# EAGLE design DRV595 (EAGLE 8.0.0)
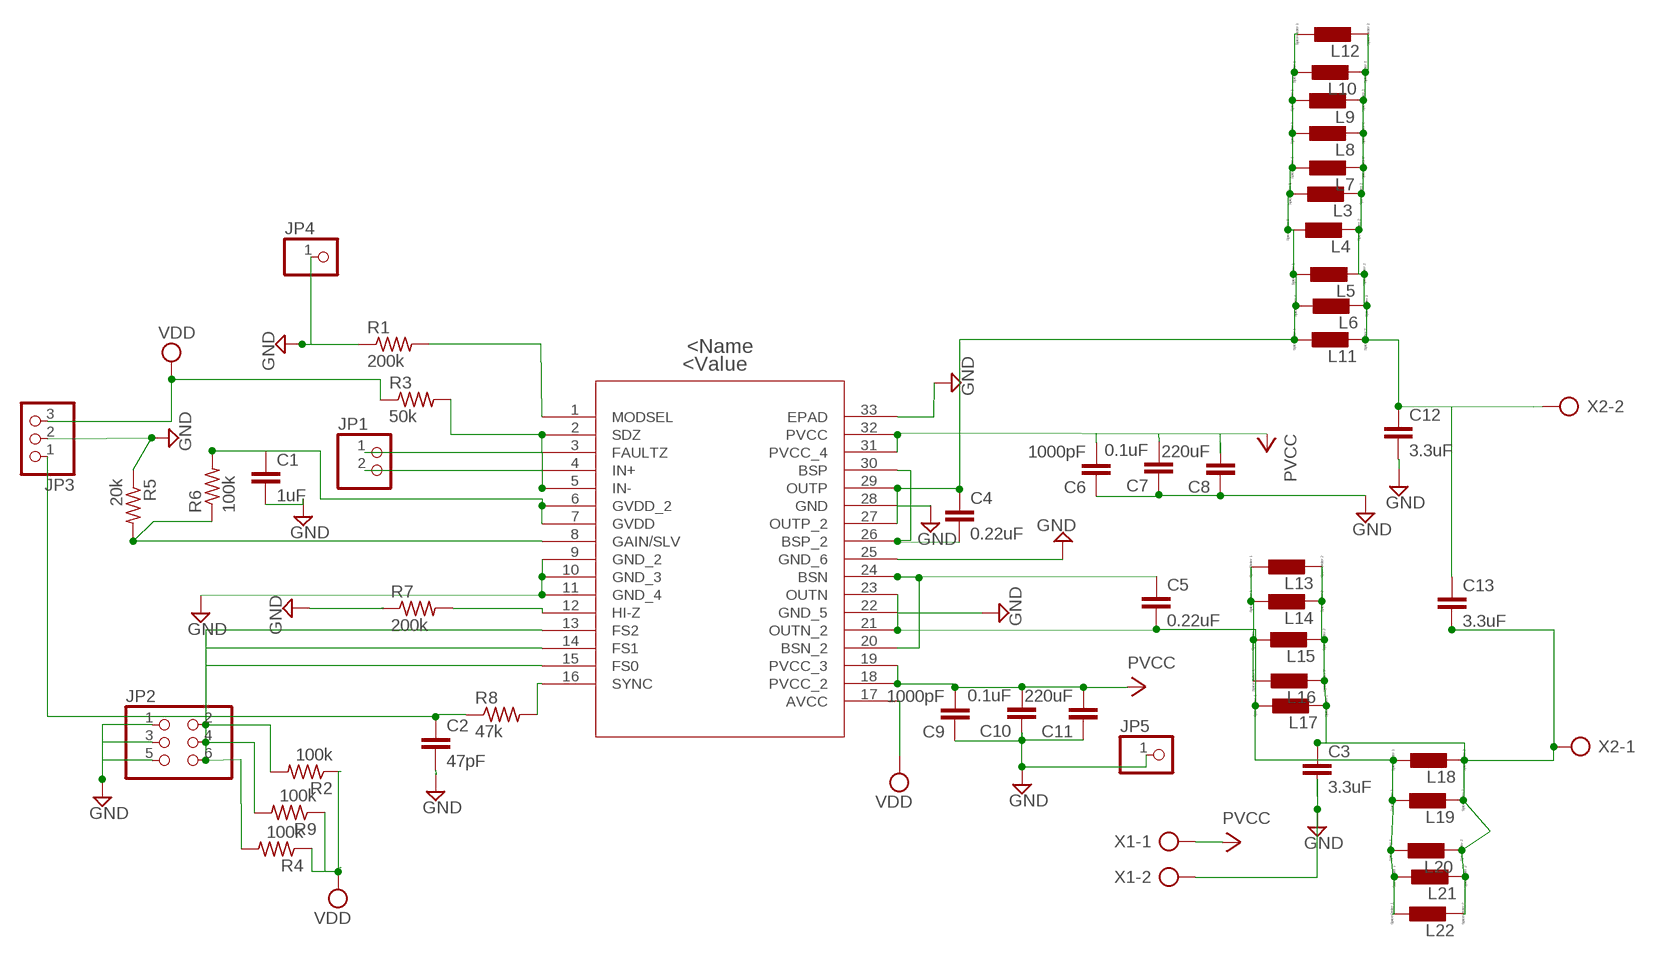
[diagram p0: schematic, sheet 1]

## Parts
C1  1uF  C2,5-3  [C2.5-3]
C2  47pF  C2,5-3  [C2.5-3]
C3  3.3uF  C2,5-3  [C2.5-3]
C4  0.22uF  C2,5-3  [C2.5-3]
C5  0.22uF  C2,5-3  [C2.5-3]
C6  1000pF  C2,5-3  [C2.5-3]
C7  0.1uF  C2,5-3  [C2.5-3]
C8  220uF  C2,5-3  [C2.5-3]
C9  1000pF  C2,5-3  [C2.5-3]
C10  0.1uF  C2,5-3  [C2.5-3]
C11  220uF  C2,5-3  [C2.5-3]
C12  3.3uF  C2,5-3  [C2.5-3]
C13  3.3uF  C2,5-3  [C2.5-3]
JP1  PINHD-1X2  [1X02]
JP2  PINHD-2X3  [2X03]
JP3  PINHD-1X3  [1X03]
JP4  PINHD-1X1  [1X01]
JP5  PINHD-1X1  [1X01]
L3  L0207/10  [0207/10]
L4  L0207/10  [0207/10]
L5  L0207/10  [0207/10]
L6  L0207/10  [0207/10]
L7  L0207/10  [0207/10]
L8  L0207/10  [0207/10]
L9  L0207/10  [0207/10]
L10  L0207/10  [0207/10]
L11  L0207/10  [0207/10]
L12  L0207/10  [0207/10]
L13  L0207/10  [0207/10]
L14  L0207/10  [0207/10]
L15  L0207/10  [0207/10]
L16  L0207/10  [0207/10]
L17  L0207/10  [0207/10]
L18  L0207/10  [0207/10]
L19  L0207/10  [0207/10]
L20  L0207/10  [0207/10]
L21  L0207/10  [0207/10]
L22  L0207/10  [0207/10]
R1  200k  R-US_0207/10  [0207/10]
R2  100k  R-US_0207/10  [0207/10]
R3  50k  R-US_0207/10  [0207/10]
R4  100k  R-US_0207/10  [0207/10]
R5  20k  R-US_0207/10  [0207/10]
R6  100k  R-US_0207/10  [0207/10]
R7  200k  R-US_0207/10  [0207/10]
R8  47k  R-US_0207/10  [0207/10]
R9  100k  R-US_0207/10  [0207/10]
U1  DRV595DAPRDAP32_4P11X4P36-L  [DAP32_4P11X4P36-L]
X1  AK300/2  [AK300/2]
X2  AK500/2-H  [AK500/2-H]

## Nets
GND: C1.2 C2.2 C3.2 C6.1 C7.1 C8.1 C9.1 C10.1 C11.1 C12.2 JP2.1 JP2.3 JP2.5 JP3.2 JP4.1 JP5.1 R1.1 R5.1 R7.1 U1.9(GND_2) U1.10(GND_3) U1.11(GND_4) U1.22(GND_5) U1.25(GND_6) U1.28(GND) U1.33(EPAD) X1.2
N$1: R1.2 U1.1(MODSEL)
N$2: JP1.1 U1.4(IN+)
N$3: R3.2 U1.2(SDZ) U1.3(FAULTZ)
N$4: R5.2 R6.1 U1.8(GAIN/SLV)
N$5: C1.1 R6.2 U1.6(GVDD_2) U1.7(GVDD)
N$6: R7.2 U1.12(HI-Z)
N$7: R8.2 U1.16(SYNC)
N$8: C2.1 JP3.1 R8.1
N$9: JP2.2 R2.2 U1.13(FS2)
N$11: C5.1 U1.20(BSN_2) U1.24(BSN)
N$12: C4.2 U1.26(BSP_2) U1.30(BSP)
N$13: JP2.4 R9.2 U1.14(FS1)
N$14: JP1.2 U1.5(IN-)
N$15: JP2.6 R4.2 U1.15(FS0)
N$16: C3.1 C13.2 L13.2 L14.2 L15.2 L16.2 L17.2 L18.2 L19.2 L20.2 L21.2 L22.2 X2.1
N$17: C12.1 C13.1 L3.2 L4.2 L5.2 L6.2 L7.2 L8.2 L9.2 L10.2 L11.2 L12.2 X2.2
N$19: C5.2 L13.1 L14.1 L15.1 L16.1 L17.1 L18.1 L19.1 L20.1 L21.1 L22.1 U1.21(OUTN_2) U1.23(OUTN)
N$21: C4.1 L3.1 L4.1 L5.1 L6.1 L7.1 L8.1 L9.1 L10.1 L11.1 L12.1 U1.27(OUTP_2) U1.29(OUTP)
VCC: C6.2 C7.2 C8.2 C9.2 C10.2 C11.2 U1.18(PVCC_2) U1.19(PVCC_3) U1.31(PVCC_4) U1.32(PVCC) X1.1 ; supply symbol labelled PVCC
VDD: JP3.3 R2.1 R3.1 R4.1 R9.1 U1.17(AVCC)

## Library data of the parts
C1-C13 = capacitor-wima:C: CAPACITOR naming: grid - package width
JP1 = pinhead:PINHD-1X2: PIN HEADER
JP2 = pinhead:PINHD-2X3: PIN HEADER
JP3 = pinhead:PINHD-1X3: PIN HEADER
JP4 JP5 = pinhead:PINHD-1X1: PIN HEADER
L3-L22 = eagle-ltspice:L: INDUCTOR, European symbol; SPICEMODEL: NONE; SPICEPREFIX: L
R1-R9 = rcl:R-US_: RESISTOR, American symbol
U1 = DRV595:DRV595DAPR; COPYRIGHT: Copyright C 2016 Accelerated Designs. All rights reserved; MANUFACTURER_PART_NUMBER: drv595dapr; VENDOR: Texas Instruments
X1 = con-ptr500:AK300/2: CONNECTOR; OC_FARNELL: unknown; OC_NEWARK: unknown
X2 = con-ptr500:AK500/2-H: CONNECTOR Aug. 2004 / PTR Meßtechnik: Die Bezeichnung der Serie AK505 wurde geändert. Es handelt sich hierbei um AK500 in horizontaler Ausführung.; OC_FARNELL: unknown; OC_NEWARK: unknown

## Net classes
0 default: width 0.254 mm, drill 1.27 mm, clearance 0.762 mm

## Board
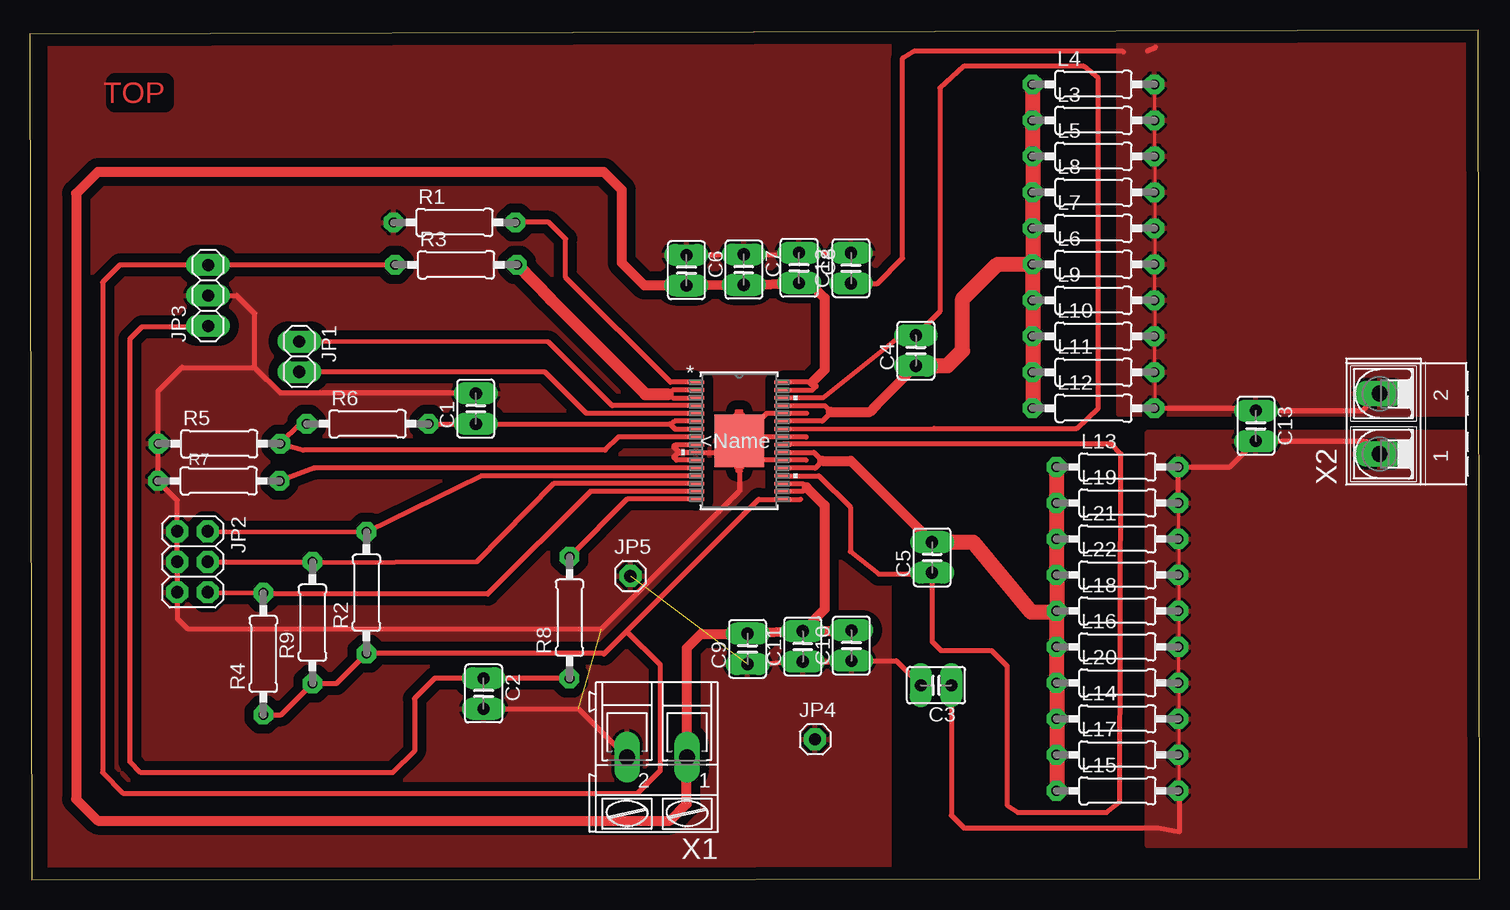
[diagram p1: board, top side]

Size 120.87 x 70.84 mm. Coordinates in mm from the lower left corner, seen from the top.
Outline: 0.15,0 120.87,0.05 120.72,70.84 0,70.49 0.15,0
Copper layers (1*16): Top 0.035mm / dielectric 1.5mm / Bottom 0.035mm
Design rules "default *": minimum track width 10mil, minimum drill 24mil, track to track 16mil, track to pad 16mil, pad to pad 16mil, via to via 16mil, smd to smd 8mil, copper to edge 40mil, drill to drill 8mil, minimum pad ring 16mil, minimum via ring 8mil, stop-mask expansion 4mil, vias tented up to drill 0mil, thermal gap 10mil

### Footprints (pad centres in the part's own frame; a part is rotated, then mirrored left to right if it is on the bottom)
C2.5-3 = drill 1.016 pad 1.6 long: 1 -1.27,0; 2 1.27,0
1X02 = drill 1.016 long: 1 -1.27,0; 2 1.27,0
2X03 = drill 1.016 octagon: 1 -2.54,-1.27; 2 -2.54,1.27; 3 0,-1.27; 4 0,1.27; 5 2.54,-1.27; 6 2.54,1.27
1X03 = drill 1.016 long: 1 -2.54,0; 2 0,0; 3 2.54,0
1X01 = drill 1.016 octagon: 1 0,0
0207/10 = drill 0.813 octagon: 1 -5.08,0; 2 5.08,0
DAP32_4P11X4P36-L = smd 1.372 x 0.305: 1 -3.619,4.875; 2 -3.619,4.225; 3 -3.619,3.575; 4 -3.619,2.925; 5 -3.619,2.275; 6 -3.619,1.625; 7 -3.619,0.975; 8 -3.619,0.325; 9 -3.619,-0.325; 10 -3.619,-0.975; 11 -3.619,-1.625; 12 -3.619,-2.275; 13 -3.619,-2.925; 14 -3.619,-3.575; 15 -3.619,-4.225; 16 -3.619,-4.875; 17 3.619,-4.875; 18 3.619,-4.225; 19 3.619,-3.575; 20 3.619,-2.925; 21 3.619,-2.275; 22 3.619,-1.625; 23 3.619,-0.975; 24 3.619,-0.325; 25 3.619,0.325; 26 3.619,0.975; 27 3.619,1.625; 28 3.619,2.275; 29 3.619,2.925; 30 3.619,3.575; 31 3.619,4.225; 32 3.619,4.875 | smd 4.11 x 4.36: 33 0,0
AK300/2 = drill 1.321 long: 1 -2.515,0; 2 2.489,0
AK500/2-H = drill 1.321 long: 1 -2.515,0; 2 2.515,0

### Placement (x,y rotation side)
C1  37.16,39.26 90 top
C2  37.81,15.51 270 top
C3  75.54,16.2 180 top
C4  73.85,44.11 90 top
C5  75.2,26.86 90 top
C6  54.72,50.8 270 top
C7  59.5,50.85 270 top
C8  64.11,51 270 top
C9  59.82,19.24 90 top
C10  68.47,19.51 90 top
C11  64.42,19.44 90 top
C12  68.44,50.98 90 top
C13  102.19,37.83 270 top
JP1  22.45,43.6 270 top
JP2  13.55,26.5 270 top
JP3  14.85,48.7 90 top
JP4  65.45,11.7 0 top
JP5  50.05,25.3 0 top
L3  88.65,63.3 0 top
L4  88.65,66.3 0 top
L5  88.65,60.3 0 top
L6  88.65,51.3 0 top
L7  88.65,54.3 0 top
L8  88.65,57.3 0 top
L9  88.65,48.3 0 top
L10  88.65,45.3 0 top
L11  88.65,42.3 0 top
L12  88.65,39.3 0 top
L13  90.65,34.4 0 top
L14  90.65,13.4 0 top
L15  90.65,7.4 0 top
L16  90.65,19.4 0 top
L17  90.65,10.4 0 top
L18  90.65,22.4 0 top
L19  90.65,31.4 0 top
L20  90.65,16.4 0 top
L21  90.65,28.4 0 top
L22  90.65,25.4 0 top
R1  35.39,54.79 0 top
R2  28.05,23.92 90 top
R3  35.51,51.26 0 top
R4  19.45,18.82 90 top
R5  15.78,36.34 0 top
R6  28.14,37.99 0 top
R7  15.73,33.24 0 top
R8  44.98,21.84 90 top
R9  23.55,21.42 90 top
U1  59.12,36.59 0 top
X1  52.25,10.2 180 top
X2  112.5,38 90 top

### Tracks (layer width: path | path; a pad name or v marks a point on that pad's centre or on a via)
GND  (2 unrouted)
  Top 0.254: 55.24,35.75 U1.10
  Top 0.406: 64.71,34.96 U1.22 59.99,34.96 59.15,35.8 | 64.71,34.96 | 64.71,36.89 64.71,36.91 U1.25 59.45,36.91 U1.33 | 64.74,38.86 U1.28 61.4,38.86 U1.33 | U1.11 53.89,34.96 53.65,35.2 54.06,35.61 U1.10 | U1.10 54.14,35.61 53.65,36.1 53.81,36.26 U1.9 | JP3.2 17.25,48.7 18.75,47.2 18.75,42.7 | 18.75,42.7 20.85,40.6 37.1,40.6 C1.2 | 18.75,42.7 12.65,42.7 10.7,40.75 R5.1 10.7,33.29 R7.1 12.28,31.61 JP2.1 JP2.3 JP2.5 12.28,21.77 13.15,20.9 47.65,20.9 59.15,32.4 59.15,35.8 | U1.10 58.15,35.61 58.74,36.21 | U1.33 58.74,36.21 | 59.15,35.8 58.74,36.21 | C6.1 59.46,52.08 C7.1 63.96,52.12 C8.1 68.41,52.28 C12.2 | C9.1 C11.1 68.97,18.16 69.05,18.24 | C2.2 45.72,14.24 X1.2 | 69.05,18.24 C10.1 | 69.05,18.24 72.22,18.24 C3.2
  pour Top: 1.65,0.8 71.65,0.8 71.65,70.9 1.65,70.9
N$1
  Top 0.406: U1.1 53.39,41.46 44.65,50.2 44.65,53.4 43.25,54.8 R1.2
N$2
  Top 0.406: U1.4 48.54,39.51 43.25,44.8 JP1.1
N$3
  Top 0.406: U1.2 53.57,40.81 53.15,40.48 53.59,40.16 U1.3
  Top 1.016: R3.2 43.42,48.35 51.3,40.48 53.15,40.48
N$4
  Top 0.406: U1.8 49.06,36.91 47.95,35.8 22.8,35.8 R5.2 22.52,37.99 R6.1
N$5
  Top 0.406: U1.6 53.74,38.21 53.43,37.91 | 53.43,37.91 53.78,37.56 U1.7 | 53.43,37.91 53.35,38 C1.1 R6.2
N$6
  Top 0.406: U1.12 23.69,34.31 R7.2
N$7
  Top 0.406: U1.16 49.78,31.71 R8.2
N$8
  Top 0.406: R8.1 37.83,16.76 C2.1 33.73,16.78 32.05,15.1 32.05,10.7 30.25,8.9 9.25,8.9 8.35,9.8 8.35,45.1 9.35,46.1 14.79,46.1 JP3.1
N$9
  Top 0.406: U1.13 37.61,33.66 R2.2 JP2.2
N$11
  Top 0.406: U1.20 65.77,33.66 68.38,31.05 68.38,27.34 70.76,25.46 75.07,25.46 C5.1 75.2,19.85 75.95,19.1 80.15,19.1 81.45,17.8 81.45,6.2 82.35,5.6 89.75,5.6 90.85,6.5 90.95,35.5 90.15,36.3 62.78,36.3 U1.24
N$12
  Top 0.406: U1.30 62.77,40.2 66.16,40.2 72.61,45.38 C4.2 | U1.26 75.39,37.61 87.26,37.61 89.05,39.3 89.05,66.8 87.85,67.8 77.85,67.8 75.85,66 75.85,47.37 C4.2 | 73.88,45.4 C4.2
N$13
  Top 0.406: U1.14 43.66,33.01 37.25,26.5 23.65,26.4 R9.2 JP2.4
N$14
  Top 0.406: U1.5 46.39,38.86 42.95,42.3 JP1.2
N$15
  Top 0.406: U1.15 46.71,32.36 38.15,23.8 19.55,23.8 R4.2 JP2.6
N$16
  Top 0.254: L15.2 95.76,7.43 95.76,9.97 L17.2 95.76,10.48 95.76,13.02 L14.2 95.76,13.53 95.76,16.07 L20.2 95.76,16.58 95.76,19.12 L16.2 95.76,19.62 95.76,22.16 L18.2 95.76,22.67 95.76,25.21 L22.2 95.76,25.72 95.76,28.26 L21.2 95.76,28.77 95.76,31.31 L19.2
  Top 0.406: C3.1 76.81,5.34 77.85,4.3 94.05,4.3 95.85,4 95.85,7.28 L15.2 | L19.2 L13.2 100.04,34.4 C13.2 111.43,36.56 X2.1
  pour Top: 120.75,2.8 93.15,2.8 93.15,37.3 120.75,37.3
N$17
  Top 0.254: L12.2 93.77,39.35 93.77,41.89 L11.2 93.77,42.4 93.77,44.94 L10.2 93.77,45.45 93.77,47.99 L9.2 93.77,48.5 93.77,51.04 L6.2 93.77,51.54 93.77,54.08 L7.2 93.77,54.59 93.77,57.13 L8.2 93.77,57.64 93.77,60.18 L5.2 93.77,60.69 93.77,63.23 L3.2 93.77,63.74 93.77,66.28 L4.2
  Top 0.406: C12.1 70.66,49.71 72.75,51.8 72.75,68.5 73.75,69.1 91.05,69.1 91.15,69 | 93.15,69.1 93.85,69.4 | 93.85,66.42 L4.2 | L12.2 101.99,39.3 C13.1 111.08,39.1 X2.2
  pour Top: 120.35,70.8 90.75,70.8 90.75,38.8 120.35,38.8
N$19
  Top 0.254: 85.6,7.43 L15.1 | 85.6,9.97 L17.1 85.6,10.48 | 85.6,13.53 L14.1 85.6,13.02 | 85.6,16.07 L20.1 85.6,16.58 | 85.6,22.67 L18.1 85.6,22.16 | 85.6,25.21 L22.1 85.6,25.72 | 85.6,28.26 L21.1 85.6,28.77 | 85.6,31.31 L19.1 85.6,31.82 | 85.6,34.36 L13.1
  Top 0.406: U1.23 65.34,35.61 66.05,34.9 65.46,34.31 U1.21 | 85.47,22.3 L18.1
  Top 0.813: 66.05,34.9 68.43,34.9 C5.2
  Top 1.27: 85.6,9.97 85.6,7.43 | 85.6,16.07 85.6,13.53 | 85.6,13.02 85.6,10.48 | 85.6,25.21 85.6,22.67 | 85.6,25.72 85.6,28.26 | 85.6,28.77 85.6,31.31 | 85.6,31.82 85.6,34.36 | L18.1 L16.1 L20.1 | C5.2 78.62,28.13 83.45,22.3 85.47,22.3
N$21
  Top 0.254: 83.61,57.64 L8.1 83.61,57.13 | 83.61,60.18 L5.1 83.61,60.69 | 83.61,63.23 L3.1 83.61,63.74 | 83.61,66.28 L4.1 | 83.61,51.54 L6.1 83.61,51.04 | 83.61,54.08 L7.1 83.61,54.59 | 83.61,39.35 L12.1 | 83.61,41.89 L11.1 83.61,42.4 | 83.61,45.45 L10.1 83.61,44.94 | 83.61,47.99 L9.1 83.61,48.5
  Top 0.406: U1.27 66.05,38.21 66.75,38.91 66.75,39 66.24,39.51 U1.29
  Top 0.813: C4.1 70.53,39.51 70.02,39 66.75,39
  Top 1.27: 83.61,60.18 83.61,57.64 | 83.61,60.69 83.61,63.23 | 83.61,63.74 83.61,66.28 | 83.61,54.08 83.61,51.54 | 83.61,41.89 83.61,39.35 | 83.61,47.99 83.61,45.45 | 83.61,44.94 83.61,42.4 | 83.61,48.5 83.61,51.04 | 83.61,54.59 83.61,57.13 | C4.1 76.49,42.84 77.75,44.1 77.75,48.4 80.65,51.3 L6.1
VCC
  Top 0.406: U1.31 65.2,40.81 65.55,41.11 65.22,41.46 U1.32 | U1.19 64.44,33.01 64.75,32.7 64.41,32.36 U1.18 | 66.25,20.7 66.24,20.7 | C10.2 68.39,20.7 | C9.2 | 54.75,10.19 X1.1
  Top 0.813: C11.2 C9.2 | 64.75,32.7 66.25,31.2 66.25,22.54 C11.2 | 66.24,20.7 C11.2 | 68.39,20.7 66.25,20.7 | 65.22,41.46 66.25,42.49 66.25,48.5 65.01,49.73 C8.2 C7.2 C6.2 51.21,49.54 49.35,51.4 49.35,57.5 47.85,59 5.65,59 3.85,57.2 3.85,6.7 5.65,4.9 53.35,4.9 54.75,6.3 54.75,10.19 | X1.1 54.76,19.31 55.95,20.5 C9.2
VDD
  Top 0.406: R4.1 20.95,13.74 R9.1 25.55,16.34 R2.1 47.89,18.84 | 64.25,31.7 62.76,31.7 U1.17 62.73,31.7 60.75,31.7 49.75,20.7 | R3.1 30.42,51.24 JP3.3 7.49,51.24 6.05,49.8 6.05,8.9 7.75,7.2 50.65,7.2 52.55,9.1 52.55,17.9 49.75,20.7 | 49.75,20.7 47.89,18.84 | 47.85,18.8 47.89,18.84

### Text on the board
Top: TOP